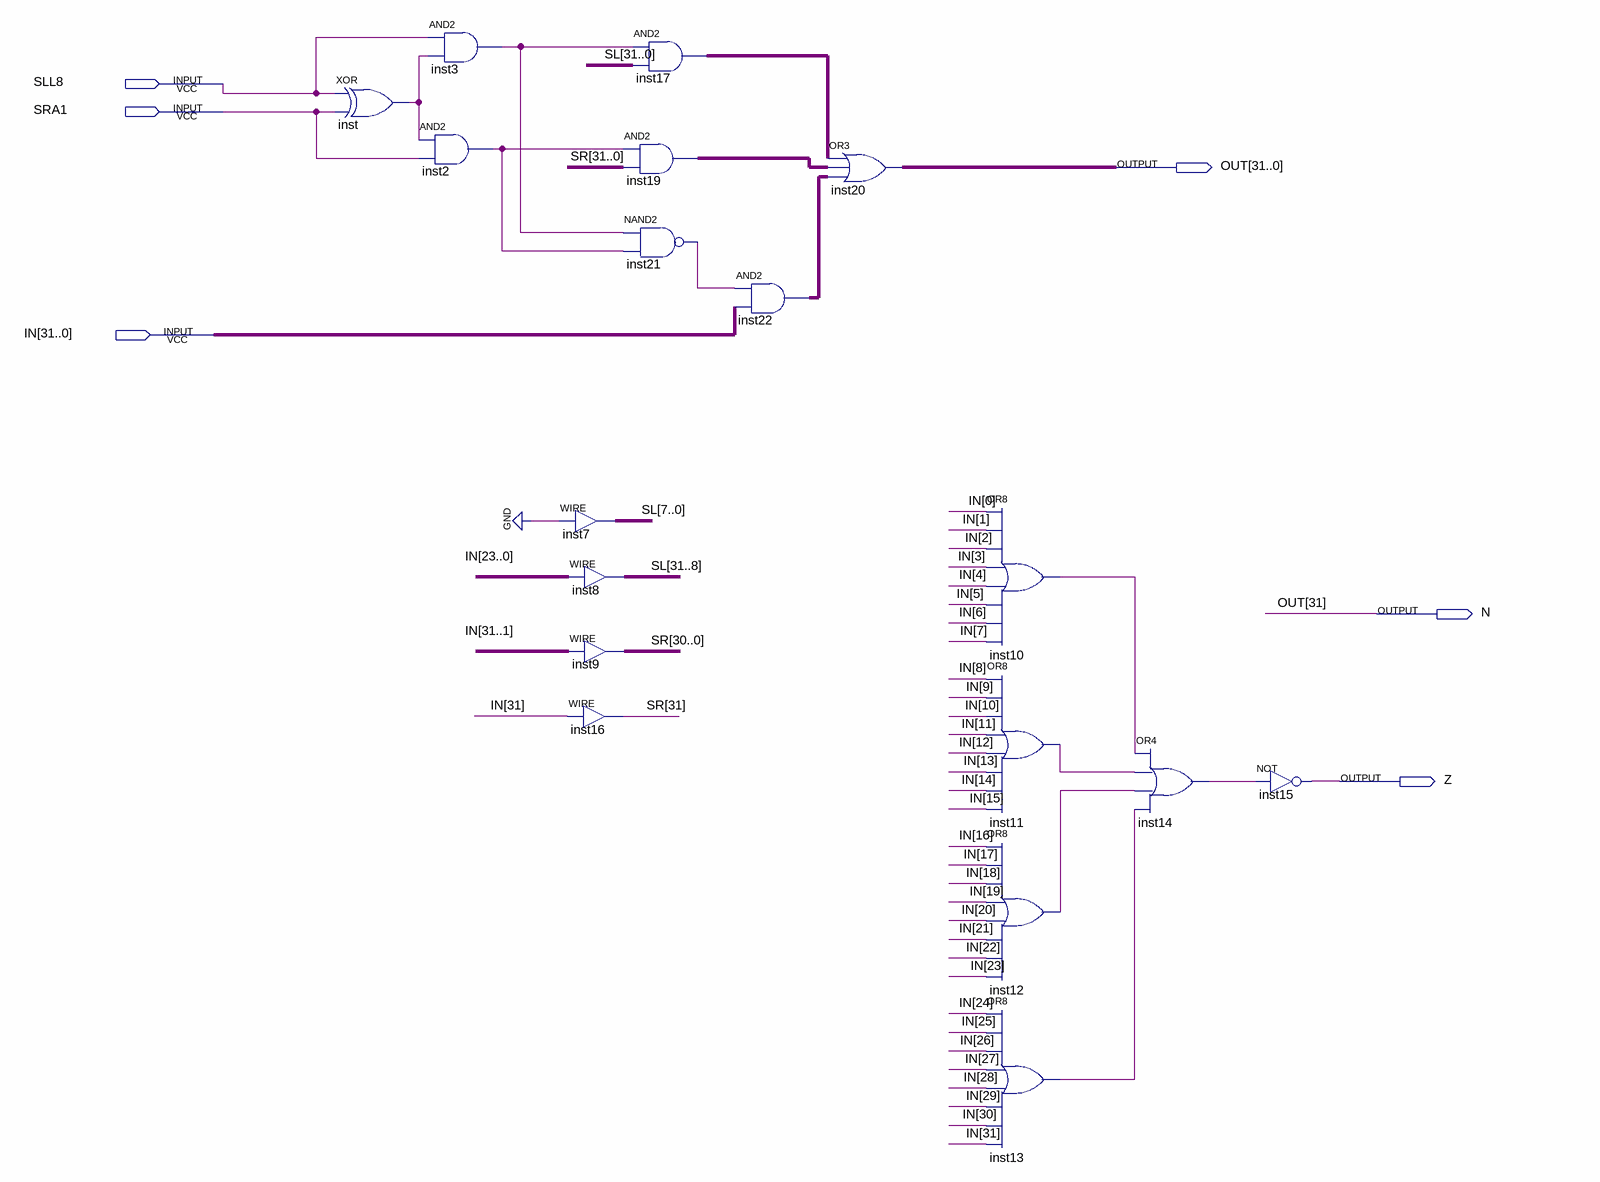
[diagram p0: schematic sheet]
// Quartus schematic SHIFTER_32BIT.bdf as structural Verilog: 18 symbols, 6 pins
module SHIFTER_32BIT (
  input  SLL8,
  input  SRA1,
  input  [31:0] IN,
  output [31:0] OUT,
  output N,
  output Z
);

  wire inst2_out, inst3_out, inst10_out, inst11_out, inst12_out, inst13_out, inst14_out, inst21_out, inst_out;
  wire [31:0] inst17_out, inst19_out, inst22_out, SL, SR;

  xor inst (inst_out, SLL8, SRA1);
  and inst3 (inst3_out, SLL8, inst_out);
  and inst2 (inst2_out, inst_out, SRA1);
  assign inst19_out = {32{inst2_out}} & SR;  // AND2 inst19, 32 bits wide
  nand inst21 (inst21_out, inst3_out, inst2_out);
  assign SL[7:0] = {8{1'b0}};  // WIRE inst7
  assign SL[31:8] = IN[23:0];  // WIRE inst8
  assign SR[30:0] = IN[31:1];  // WIRE inst9
  assign SR[31] = IN[31];  // WIRE inst16
  assign inst17_out = {32{inst3_out}} & SL;  // AND2 inst17, 32 bits wide
  assign inst22_out = {32{inst21_out}} & IN;  // AND2 inst22, 32 bits wide
  assign {N, OUT[30:0]} = inst17_out | inst19_out | inst22_out;  // OR3 inst20, 32 bits wide
  or inst10 (inst10_out, IN[0], IN[1], IN[2], IN[3], IN[4], IN[5], IN[6], IN[7]);
  or inst11 (inst11_out, IN[8], IN[9], IN[10], IN[11], IN[12], IN[13], IN[14], IN[15]);
  or inst12 (inst12_out, IN[16], IN[17], IN[18], IN[19], IN[20], IN[21], IN[22], IN[23]);
  or inst13 (inst13_out, IN[24], IN[25], IN[26], IN[27], IN[28], IN[29], IN[30], IN[31]);
  or inst14 (inst14_out, inst10_out, inst11_out, inst12_out, inst13_out);
  not inst15 (Z, inst14_out);

  assign OUT[31] = N;
endmodule
